# EAGLE design Adafruit PCA9685 rev C (EAGLE 9.6.2)
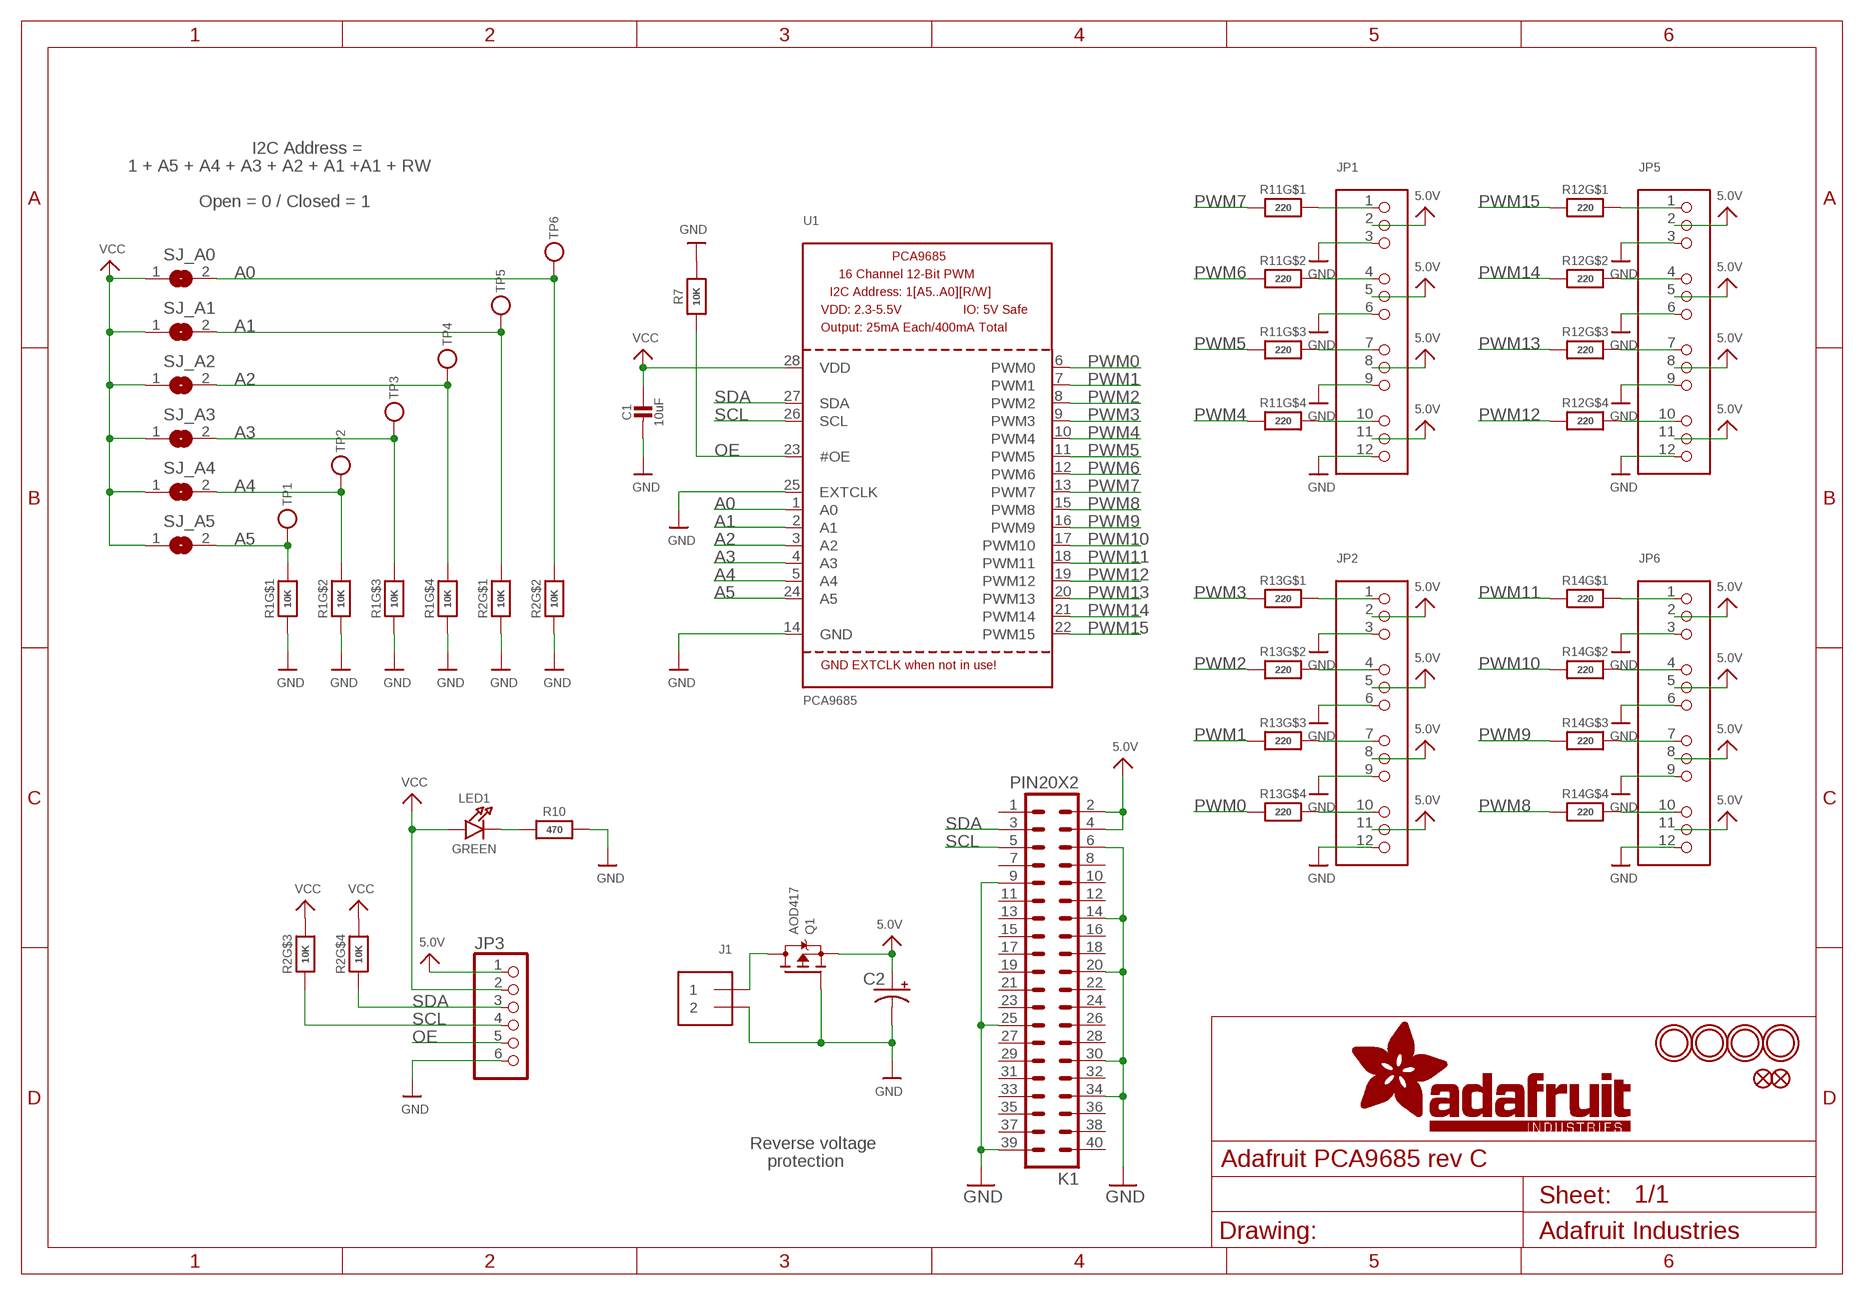
[diagram p0: schematic, sheet 1]

## Parts
C1  10uF  CAP_CERAMIC0805-NOOUTLINE  [0805-NO]
C2  CPOL-USE3.5-8  [E3,5-8]
FID1  FIDUCIAL""  [FIDUCIAL_1MM]
FID2  FIDUCIAL""  [FIDUCIAL_1MM]
J1  TERMBLOCK_1X2  [TERMBLOCK_1X2-3.5MM]
JP1  HEADER-3X04  [3X04]
JP2  HEADER-3X04  [3X04]
JP3  PINHD-1X6CB  [1X06-CLEANBIG]
JP5  HEADER-3X04  [3X04]
JP6  HEADER-3X04  [3X04]
K1  PIN20X2  [PIN_20X2]
LED1  GREEN  LED0805_NOOUTLINE  [CHIPLED_0805_NOOUTLINE]
Q1  AOD417  MOSFET-PTO252  [TO252]
R1  10K  RESISTOR_4PACK  [RESPACK_4X0603]
R2  10K  RESISTOR_4PACK  [RESPACK_4X0603]
R7  10K  RESISTOR0805_NOOUTLINE  [0805-NO]
R10  470  RESISTOR_0805MP  [_0805MP]
R11  220  RESISTOR_4PACK  [RESPACK_4X0603]
R12  220  RESISTOR_4PACK  [RESPACK_4X0603]
R13  220  RESISTOR_4PACK  [RESPACK_4X0603]
R14  220  RESISTOR_4PACK  [RESPACK_4X0603]
SJ_A0  SOLDERJUMPERREFLOW_NOPASTE  [SOLDERJUMPER_REFLOW_NOPASTE]
SJ_A1  SOLDERJUMPERREFLOW_NOPASTE  [SOLDERJUMPER_REFLOW_NOPASTE]
SJ_A2  SOLDERJUMPERREFLOW_NOPASTE  [SOLDERJUMPER_REFLOW_NOPASTE]
SJ_A3  SOLDERJUMPERREFLOW_NOPASTE  [SOLDERJUMPER_REFLOW_NOPASTE]
SJ_A4  SOLDERJUMPERREFLOW_NOPASTE  [SOLDERJUMPER_REFLOW_NOPASTE]
SJ_A5  SOLDERJUMPERREFLOW_NOPASTE  [SOLDERJUMPER_REFLOW_NOPASTE]
TP1  TESTPOINTROUND1MM  [TESTPOINT_ROUND_1MM]
TP2  TESTPOINTROUND1MM  [TESTPOINT_ROUND_1MM]
TP3  TESTPOINTROUND1MM  [TESTPOINT_ROUND_1MM]
TP4  TESTPOINTROUND1MM  [TESTPOINT_ROUND_1MM]
TP5  TESTPOINTROUND1MM  [TESTPOINT_ROUND_1MM]
TP6  TESTPOINTROUND1MM  [TESTPOINT_ROUND_1MM]
U1  PCA9685  [TSSOP28]
U$47  MOUNTINGHOLE2.5  [MOUNTINGHOLE_2.5_PLATED]
U$48  MOUNTINGHOLE2.5  [MOUNTINGHOLE_2.5_PLATED]
U$49  MOUNTINGHOLE2.5  [MOUNTINGHOLE_2.5_PLATED]
U$50  MOUNTINGHOLE2.5  [MOUNTINGHOLE_2.5_PLATED]

## Nets
5.0V: C2.+ JP1.2 JP1.5 JP1.8 JP1.11 JP2.2 JP2.5 JP2.8 JP2.11 JP3.1 JP5.2 JP5.5 JP5.8 JP5.11 JP6.2 JP6.5 JP6.8 JP6.11 K1.2 K1.4 Q1.2(S)
A0: R2.7 SJ_A0.2 TP6.P$1 U1.1(A0)
A1: R2.8 SJ_A1.2 TP5.P$1 U1.2(A1)
A2: R1.5 SJ_A2.2 TP4.P$1 U1.3(A2)
A3: R1.6 SJ_A3.2 TP3.P$1 U1.4(A3)
A4: R1.7 SJ_A4.2 TP2.P$1 U1.5(A4)
A5: R1.8 SJ_A5.2 TP1.P$1 U1.24(A5)
GND: C1.2 C2.- J1.2 JP1.3 JP1.6 JP1.9 JP1.12 JP2.3 JP2.6 JP2.9 JP2.12 JP3.6 JP5.3 JP5.6 JP5.9 JP5.12 JP6.3 JP6.6 JP6.9 JP6.12 K1.6 K1.9 K1.14 K1.20 K1.25 K1.30 K1.34 K1.39 Q1.1(G) R1.1 R1.2 R1.3 R1.4 R2.1 R2.2 R7.2 R10.2 U1.14(GND) U1.25(EXTCLK)
N$1: LED1.C R10.1
N$2: JP1.4 R11.7
N$3: JP1.1 R11.8
N$4: JP1.7 R11.6
N$5: JP1.10 R11.5
N$6: JP2.1 R13.8
N$7: JP2.4 R13.7
N$8: JP2.7 R13.6
N$9: JP2.10 R13.5
N$10: JP6.10 R14.5
N$11: JP6.7 R14.6
N$12: JP6.4 R14.7
N$13: JP6.1 R14.8
N$14: JP5.10 R12.5
N$15: JP5.7 R12.6
N$16: JP5.4 R12.7
N$17: JP5.1 R12.8
OE: JP3.5 R7.1 U1.23(#OE)
PWM0: R13.4 U1.6(PWM0)
PWM1: R13.3 U1.7(PWM1)
PWM2: R13.2 U1.8(PWM2)
PWM3: R13.1 U1.9(PWM3)
PWM4: R11.4 U1.10(PWM4)
PWM5: R11.3 U1.11(PWM5)
PWM6: R11.2 U1.12(PWM6)
PWM7: R11.1 U1.13(PWM7)
PWM8: R14.4 U1.15(PWM8)
PWM9: R14.3 U1.16(PWM9)
PWM10: R14.2 U1.17(PWM10)
PWM11: R14.1 U1.18(PWM11)
PWM12: R12.4 U1.19(PWM12)
PWM13: R12.3 U1.20(PWM13)
PWM14: R12.2 U1.21(PWM14)
PWM15: R12.1 U1.22(PWM15)
PWRIN: J1.1 Q1.3(D)
SCL: JP3.4 K1.5 R2.3 U1.26(SCL)
SDA: JP3.3 K1.3 R2.4 U1.27(SDA)
VCC: C1.1 JP3.2 LED1.A R2.5 R2.6 SJ_A0.1 SJ_A1.1 SJ_A2.1 SJ_A3.1 SJ_A4.1 SJ_A5.1 U1.28(VDD)
Unconnected: K1.1 K1.7 K1.8 K1.10 K1.11 K1.12 K1.13 K1.15 K1.16 K1.17 K1.18 K1.19 K1.21 K1.22 K1.23 K1.24 K1.26 K1.27 K1.28 K1.29 K1.31 K1.32 K1.33 K1.35 K1.36 K1.37 K1.38 K1.40

## Notes on the sheet
- I2C Address =
- 1 + A5 + A4 + A3 + A2 + A1 +A1 + RW
- Open = 0 / Closed = 1
- Reverse voltage
- protection

## Library data of the parts
C1 = microbuilder:CAP_CERAMIC: Ceramic Capacitors For new designs, use the packages preceded by an '_' character since they are more reliable: The following footprints should be used on most boards: _0402 - Standard footprint for regular board layouts _0603 - Standard footprint for regular board layouts _0805 - Standard footprint for regular board layouts _1206 - Standard footprint for regular board layouts For extremely tight-pitch boards where space is at a premium, the following 'micro-pitch' footprints can be used (smaller pads, no silkscreen outline, etc.): _0402MP - Micro-pitch footprint for very dense/compact boards _0603MP - Micro-pitch footprint for very dense/compact boards _0805MP - Micro-pitch footprint for very dense/compact boards _1206MP - Micro-pitch footprint for very dense/compact boards
C2 = adafruit:CPOL-US: POLARIZED CAPACITOR, American symbol
FID1 FID2 = microbuilder:FIDUCIAL: Fiducial Alignment Points Various fiducial points for machine vision alignment.; BOM: EXCLUDE
J1 = microbuilder:TERMBLOCK_1X2: 3.5mm Terminal block http://www.ladyada.net/library/pcb/eaglelibrary.html
JP1 JP2 JP5 JP6 = microbuilder:HEADER-3X04
JP3 = adafruit:PINHD-1X6: PIN HEADER
K1 = FLYFISH:PIN20X2
LED1 = microbuilder:LED: LED 0603 - 0603 Surface Mount Package 2mA: Green LED - Low Power (3.9mcd, 2ma, 1.7Vf) - Digikey: 475-2709-2-ND Orange LED - Low Power (9.8mcd, 2ma, 1.8Vf) - Digikey: 475-1194-2-ND Red LED - Low Power (5mcd, 2ma, 1.8Vf) - Digikey: 475-1195-2-ND Yellow LED - Low Power (7mcd, 2ma, 1.8Vf) - Digikey: 475-1196-2-ND 5mA: Blue LED - Low Power (17mcd, 5ma, 2.9Vf) - Digikey: LNJ937W8CRACT-ND 0805 - 0805 Surface Mount Package 2mA: Red LED (8.8mcd, 2mA, 1.8Vf, Clear) - Low Power [Digikey: 475-2510-1-ND] Green LED (5mcd, 2mA, 1.8Vf, Clear) - Low Power [Digikey: 475-2730-1-ND] Yellow LED (11.3mcd, 2mA, 1.8Vf, Clear) - Low Power [Digikey: 475-2555-1-ND] 20mA: Red LED (104mcd, 20mA, Diffused) - LS R976 [Digikey: 475-1278-6-ND] Red LED (12mcd, 20mA, 2.0Vf, Clear) - APT2012EC [Digikey: 754-1128-1-ND] Green LED (15mcd, 20mA, 2.2Vf, Clear) - APT2012GC [Digikey: 754-1131-1-ND] Orange LED (160mcd, 20mA, 2.1Vf, Clear) - APT2012SECK [Digikey: 754-1130-1-ND] 1206 - 1206 Surface Mount Package Green LED (26mcd, 20mA, Diffused) - LG N971 [Digikey: 475-1407-6-ND] Red LED (15mcd, 20mA, Diffused) - LH N974 [Digikey: 475-1416-6-ND] Cree - Cree High-Power Surface Mount LEDs XPEBWT-L1-0000-00D50 - White 111lm 350mA 2.9Vf 6200K 110° XTEAWT-00-0000-00000LEE3 - White 114lm 350mA 2.85Vf 5000K 115° Everlight - Everlight 45-21 Series Surface Mount LEDs 45-21/QK2C-B2832AC2CB2/2T - Warm White 2000mcd 20mA 3.25Vf 3050K 120° 45-21/LK2C-B38452C4CB2/2T - Nuetral White 2000mcd 20mA 3.25Vf 4150K 120° 45-21/LK2C-B50634C6CB2/2T - Cold White 2200mcd 20mA 3.25Vf 5650K 120° PLCC2 Reverse Mount LS T77K-J1L2-1-0-2-R18-Z - Red 11.25mcd 2mA 1.8Vf 630nm 120° LO T77K-L1M2-24-Z - Orange 19.6mcd 2mA 1.8Vf 606nm 120° LY T77K-K2M1-26-Z - Yellow 15.7mcd 2mA 1.8Vf 587nm 120°
Q1 = microbuilder:MOSFET-P: P-Channel Mosfet LEGEND VDS: Voltage Drain-Source ID: Drain Current RDS(ON): Drain-Source On-State Resistance VGS(TH): Gate-Source Threshold Voltage CISS: Drain-Source Input Capacitance SOT-23 Name VDS ID RDS(ON) VGS(TH) CISS Order Number IRLML5103 30V 760mA 600 mOhm -- 75pF @ 25V Digikey: IRLML5103PBFCT-ND IRLML6401 12V 4.3A 50 mOhm 950mV @ 250µA 830pF @ 10V Digikey: IRLML6401PBFTR-ND NTR0202PL 20V 400mA 800 mOhm 2.3V @ 250uA 70pF @ 5V Digikey: NTR0202PLT1GOSTR-ND NTR4101PT1G 20V 1.8A 85 mOhm 1.2V @ 250uA 675pF @ 10V Digikey: NTR4101PT1GOSCT-ND DMP2004K 20V 600mA 900 mOhm 1V @ 250uA 175pF @ 16V Digikey: DMP2004KDICT-ND PMV65XP 20V 3.9A 76 mOhm 950mV @ 1mA 725pF @ 20V Digikey: 568-2358-2-ND TO-252 Name VDS ID RDS(ON) VGS(TH) CISS Order Number AOD417 30V 25A 34 mOhm 3V @ 250µA 920pF @ 15V Digikey: 785-1106-2-ND
R1 R2 R11-R14 = microbuilder:RESISTOR_4PACK: Resistor Packs (4 resistors) 4 x 0603 10K 1/16W - Digikey: YC164J-10KCT-ND
R7 R10 = microbuilder:RESISTOR: Resistors For new designs, use the packages preceded by an '_' character since they are more reliable: The following footprints should be used on most boards: _0402 - Standard footprint for regular board layouts _0603 - Standard footprint for regular board layouts _0805 - Standard footprint for regular board layouts _1206 - Standard footprint for regular board layouts For extremely tight-pitch boards where space is at a premium, the following 'micro-pitch' footprints can be used (smaller pads, no silkscreen outline, etc.): _0402MP - Micro-pitch footprint for very dense/compact boards _0603MP - Micro-pitch footprint for very dense/compact boards _0805MP - Micro-pitch footprint for very dense/compact boards _1206MP - Micro-pitch footprint for very dense/compact boards
SJ_A0 SJ_A1-SJ_A5 = microbuilder:SOLDERJUMPER: SMD Solder JUMPER Solder the two pads together to create a connection, or remove the solder to break it. REFLOW - Use this footprint for solder paste and reflow ovens. WAVE - Use this footprint for hand-soldering (larger pads). CLOSED - Has a trace between the two pads to ensure it is closed by default. The trace needs to be cut to disable the jumper, and can be closed again by creating a solder bridge between the two pads.
TP1-TP6 = microbuilder:TESTPOINT: Test Point Various test points for characterisation and PCB testing TESTPOINT_SMT - Compact Surface Mount Test Point [Digikey: 5016KTR-ND]
U1 = microbuilder:PCA9685: PCA9685 - 16 Channel 12-Bit I2C PWM Controller 5.0V tolerant 16 channel, 12-bit I2C PWM controller with 25mA per output (max. 400mA total) Digikey: 568-5931-1-ND
U$47-U$50 = microbuilder:MOUNTINGHOLE: Mounting Hole For #2 screws (0.086"/2.18mm width, 0.094"/2.4mm hole) use 2.5mm; BOM: EXCLUDE

## Board
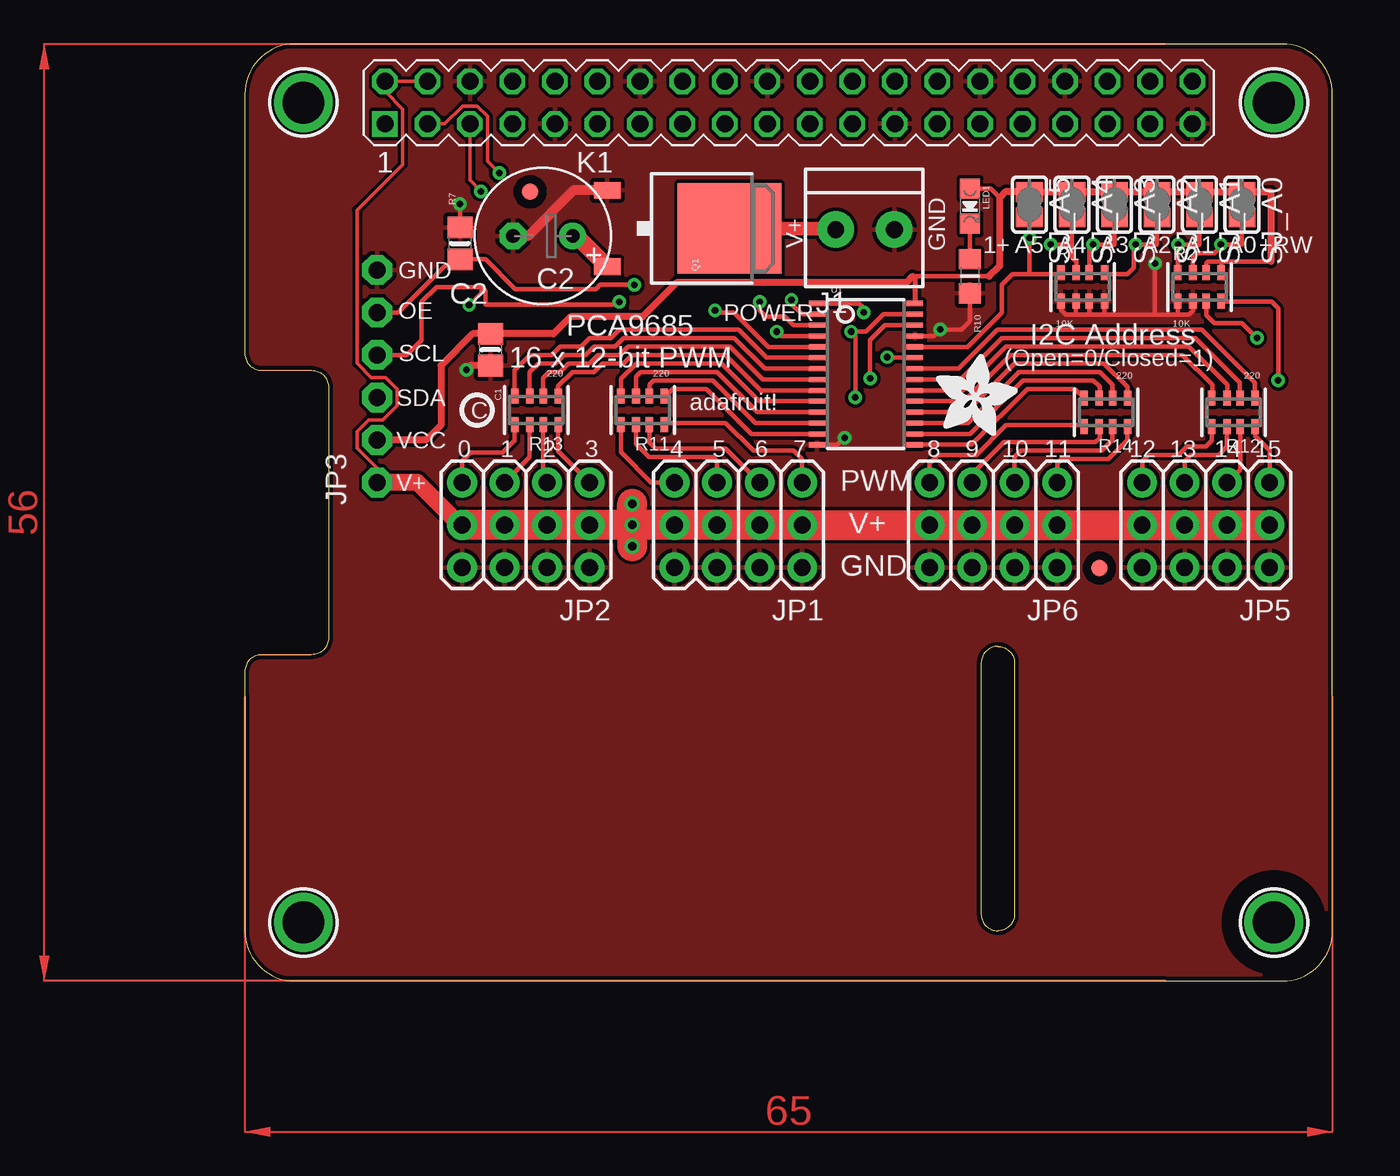
[diagram p1: board, top side]
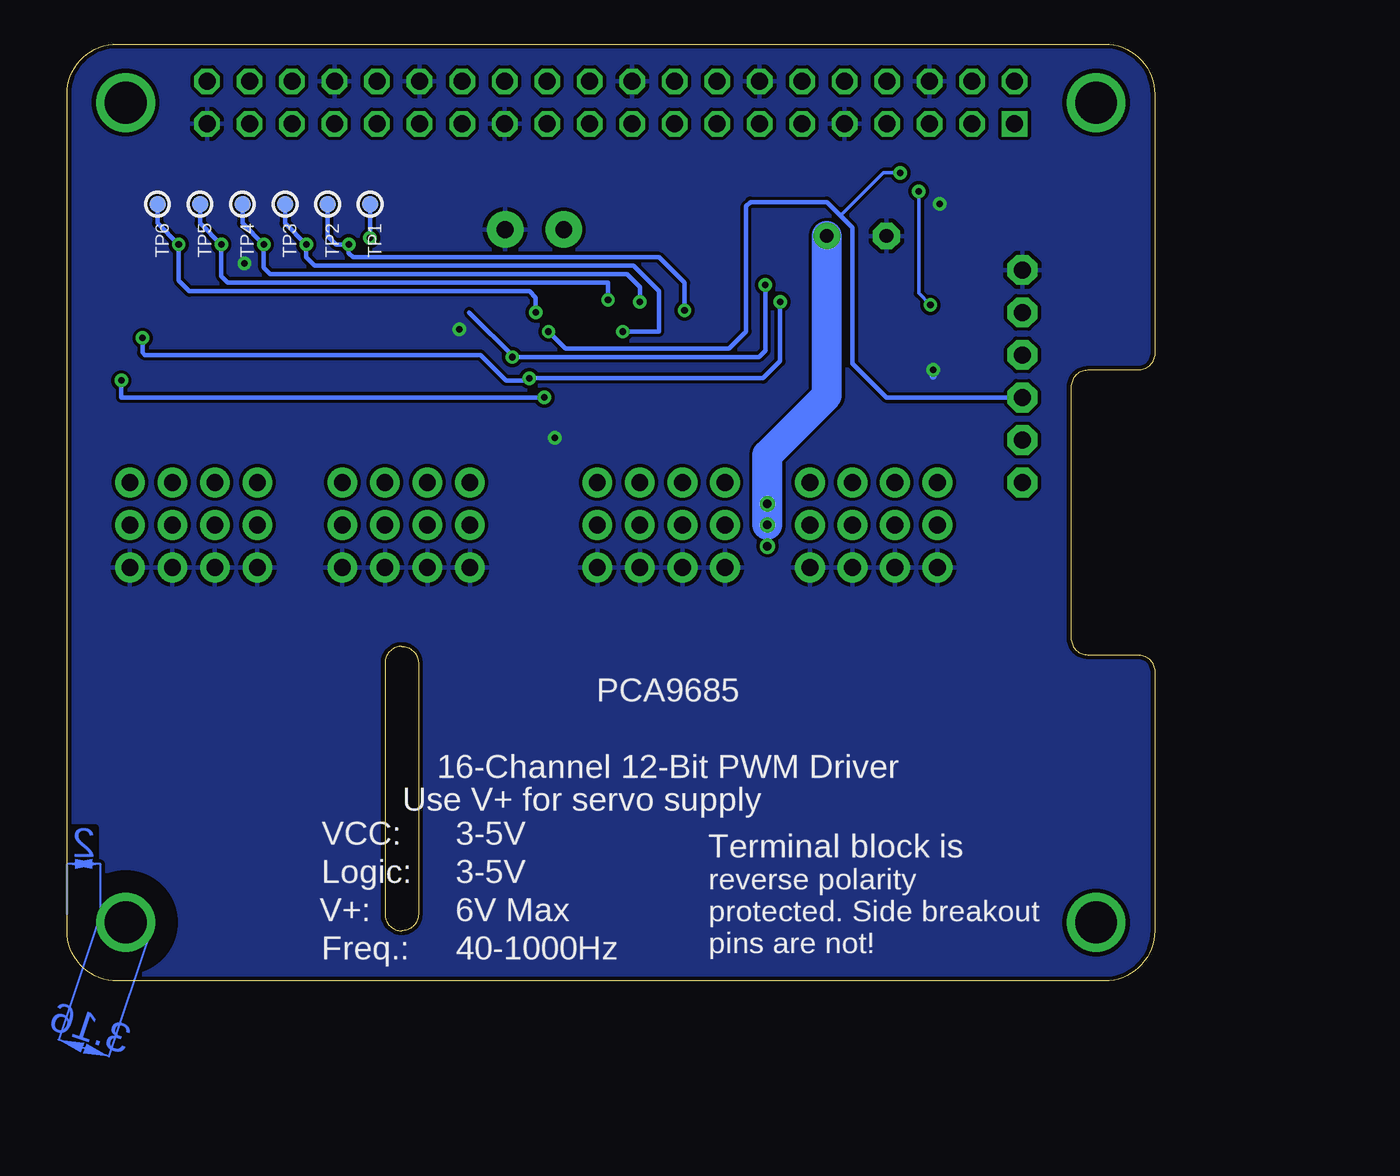
[diagram p2: board, bottom side, seen from below]

Size 65 x 56 mm. Coordinates in mm from the lower left corner, seen from the top.
Outline: 0,3 arc90 3,0 62,0 arc90 65,3 65,53 arc90 62,56 3,56 arc90 0,53 0,37.5 arc90 1,36.5 4,36.5 arc-90 5,35.5 5,20.5 arc-90 4,19.5 1,19.5 arc90 0,18.5 0,3
Outline: 44,19 44,4 arc90 45,3 arc90 46,4 46,19 arc90 45,20 arc90 44,19
Copper layers (1*16): Top 0.035mm / dielectric 1.5mm / Bottom 0.035mm
Design rules "adafruit": minimum track width 8mil, minimum drill 15.5mil, track to track 8mil, track to pad 8mil, pad to pad 8mil, via to via 8mil, smd to smd 8mil, copper to edge 10mil, drill to drill 8mil, minimum pad ring 10mil, minimum via ring 8mil, stop-mask expansion 2mil, vias tented up to drill 20mil, thermal gap 10mil
tRestrict: area -114.2,73.7 to -111.1,76.8; area -56.2,73.7 to -53.1,76.8; area -56.2,24.7 to -53.1,27.8; area -114.2,24.7 to -111.1,27.8; area -95,71 to -92,74; area -37,71 to -34,74; area -37,21.9 to -34,25.1; area -95,21.9 to -92,25.1; area 60,1.9 to 63,5
bRestrict: area -114.2,24.7 to -111.1,27.8; area -114.2,73.7 to -111.1,76.8; area -56.2,24.7 to -53.1,27.8; area -56.2,73.7 to -53.1,76.8; area -95,21.9 to -92,25.1; area -95,71 to -92,74; area -37,21.9 to -34,25.1; area -37,71 to -34,74; area 60,1.9 to 63,5

### Footprints (pad centres in the part's own frame; a part is rotated, then mirrored left to right if it is on the bottom)
0805-NO = smd 1.3 x 1.5: 1 -0.95,0; 2 0.95,0
E3,5-8 = drill 0.813 pad 1.6: + -1.778,0 | drill 0.813 pad 1.6 octagon: - 1.778,0
FIDUCIAL_1MM = smd 1 x 1: 1 0,0
TERMBLOCK_1X2-3.5MM = drill 1 pad 2.184: 1 1.8,0; 2 -1.7,0
3X04 = drill 1 pad 1.778: 1 -3.81,-2.54; 2 -3.81,0; 3 -3.81,2.54; 4 -1.27,-2.54; 5 -1.27,0; 6 -1.27,2.54; 7 1.27,-2.54; 8 1.27,0; 9 1.27,2.54; 10 3.81,-2.54; 11 3.81,0; 12 3.81,2.54
1X06-CLEANBIG = drill 1.016 pad 1.778 octagon: 1 -6.35,0; 2 -3.81,0; 3 -1.27,0; 4 1.27,0; 5 3.81,0; 6 6.35,0
PIN_20X2 = drill 1.016 square: 1 -24.13,-1.27 | drill 1.016 octagon: 2 -24.13,1.27; 3 -21.59,-1.27; 4 -21.59,1.27; 5 -19.05,-1.27; 6 -19.05,1.27; 7 -16.51,-1.27; 8 -16.51,1.27; 9 -13.97,-1.27; 10 -13.97,1.27; 11 -11.43,-1.27; 12 -11.43,1.27; 13 -8.89,-1.27; 14 -8.89,1.27; 15 -6.35,-1.27; 16 -6.35,1.27; 17 -3.81,-1.27; 18 -3.81,1.27; 19 -1.27,-1.27; 20 -1.27,1.27; 21 1.27,-1.27; 22 1.27,1.27; 23 3.81,-1.27; 24 3.81,1.27; 25 6.35,-1.27; 26 6.35,1.27; 27 8.89,-1.27; 28 8.89,1.27; 29 11.43,-1.27; 30 11.43,1.27; 31 13.97,-1.27; 32 13.97,1.27; 33 16.51,-1.27; 34 16.51,1.27; 35 19.05,-1.27; 36 19.05,1.27; 37 21.59,-1.27; 38 21.59,1.27; 39 24.13,-1.27; 40 24.13,1.27
CHIPLED_0805_NOOUTLINE = smd 1.2 x 1.2: A 0,-1.05; C 0,1.05
TO252 = smd 1 x 1.6: 1 -2.28,-4.8; 2 2.28,-4.8 | smd 5.4 x 6.2: 3 0,2.5
RESPACK_4X0603 = smd 0.45 x 0.9: 1 -1.3,-0.85; 2 -0.4,-0.85; 3 0.4,-0.85; 4 1.3,-0.85; 5 1.3,0.85; 6 0.4,0.85; 7 -0.4,0.85; 8 -1.3,0.85
_0805MP = smd 1.2 x 1.3: 1 -1.016,0; 2 1.016,0
SOLDERJUMPER_REFLOW_NOPASTE = smd 1.168 x 1.6: 1 -0.762,0; 2 0.762,0
TESTPOINT_ROUND_1MM = smd 1 x 1: P$1 0,0
TSSOP28 = smd 0.305 x 0.991: 1 -4.225,-2.918; 2 -3.575,-2.918; 3 -2.925,-2.918; 4 -2.275,-2.918; 5 -1.625,-2.918; 6 -0.975,-2.918; 7 -0.325,-2.918; 8 0.325,-2.918; 9 0.975,-2.918; 10 1.625,-2.918; 11 2.275,-2.918; 12 2.925,-2.918; 13 3.575,-2.918; 14 4.225,-2.918; 15 4.225,2.918; 16 3.575,2.918; 17 2.925,2.918; 18 2.275,2.918; 19 1.625,2.918; 20 0.975,2.918; 21 0.325,2.918; 22 -0.325,2.918; 23 -0.975,2.918; 24 -1.625,2.918; 25 -2.275,2.918; 26 -2.925,2.918; 27 -3.575,2.918; 28 -4.225,2.918
MOUNTINGHOLE_2.5_PLATED = drill 2.5 pad 3.2: P$1 0,0

### Placement (x,y rotation side)
C1  14.68,37.73 270 top
C2  17.81,44.53 180 top
FID1  51.07,24.68 0 top
FID2  17.05,47.17 0 top
J1  37.12,44.91 180 top
JP1  29.5,27.26 180 top
JP2  16.8,27.26 180 top
JP3  7.91,36.15 90 top
JP5  57.44,27.26 180 top
JP6  44.73,27.26 180 top
K1  32.5,52.5 0 top
LED1  43.34,46.31 180 top
Q1  26.46,44.97 270 top
R1  50.07,41.48 0 top
R2  57.05,41.48 0 top
R7  12.86,44.08 90 top
R10  43.34,42.12 270 top
R11  23.78,34.11 180 top
R12  59.09,33.99 180 top
R13  17.43,34.11 180 top
R14  51.47,33.99 180 top
SJ_A0  59.59,46.4 270 top
SJ_A1  57.05,46.4 270 top
SJ_A2  54.51,46.4 270 top
SJ_A3  51.97,46.4 270 top
SJ_A4  49.43,46.4 270 top
SJ_A5  46.89,46.4 270 top
TP1  46.89,46.43 270 bottom
TP2  49.43,46.43 270 bottom
TP3  51.97,46.43 270 bottom
TP4  54.51,46.43 270 bottom
TP5  57.05,46.43 270 bottom
TP6  59.59,46.43 270 bottom
U1  37.12,36.27 270 top
U$47  61.5,52.5 0 top
U$48  3.5,52.5 0 top
U$49  3.5,3.5 0 top
U$50  61.5,3.5 0 top
U$51  [ADAFRUIT_5MM]  41.31,32.59 0 top
U$54  [PCBFEAT-REV-040]  13.87,34.11 0 top

### Tracks (layer width: path | path; a pad name or v marks a point on that pad's centre or on a via)
5.0V  (via drill 0.5)
  Top 0.203: K1.4 K1.2 8.37,53.19 9.44,52.12 9.44,48.8 6.71,46.08 6.71,36.92 7.56,36.07 8.4,36.07 9.1,35.37 9.1,34.38 8.25,33.53 7.41,33.53 6.71,32.83 6.71,31.84 7.91,30.65 JP3.1
  Top 0.254: JP2.11 12.86,27.26 | JP5.2 61.63,27.26
  Top 1.016: JP3.1 10.32,29.8 12.86,27.26 | Q1.2 19.83,44.53 C2.+
  Top 1.778: JP2.11 JP2.8 JP2.5 JP2.2 v23.14,27.26 | v23.14,27.26 JP1.11 JP1.8 JP1.5 JP1.2 JP6.11 JP6.8 JP6.5 JP6.2 JP5.11 JP5.8 JP5.5 JP5.2 | v23.14,27.26 v23.14,28.53 | v23.14,27.26 v23.14,25.99
  Bottom 1.778: C2.+ 19.59,35 23.14,31.45 v23.14,27.26
A0  (via drill 0.39)
  Top 0.254: SJ_A0.2 59.59,44.02 v58.32,44.02 58.32,43.89 57.94,43.51 56.93,43.51 56.65,43.24 R2.7 | v36.99,39.96 36.99,40.21 36.7,40.5 U1.1
  Bottom 0.254: v36.99,39.96 36.99,40.84 37.37,41.23 57.69,41.23 58.32,41.86 v58.32,44.02 59.59,45.29 TP6.P$1
A1  (via drill 0.39)
  Top 0.254: SJ_A1.2 57.05,44.02 v55.78,44.02 55.75,43.99 R2.8 | U1.2 33.29,39.85 32.67,40.46 v32.67,40.72
  Bottom 0.254: v32.67,40.72 32.67,41.73 55.4,41.73 55.78,42.12 v55.78,44.02 57.05,45.29 TP5.P$1
A2  (via drill 0.39)
  Top 0.254: SJ_A2.2 54.51,44.02 v53.24,44.02 53.12,43.89 53.12,42.62 52.74,42.24 51.46,42.24 R1.5 | U1.3 32.79,39.2 32.29,39.7 31.15,39.7 30.77,40.08 v30.77,40.59
  Bottom 0.254: v30.77,40.59 30.77,41.48 31.53,42.24 52.86,42.24 53.24,42.62 v53.24,44.02 54.51,45.29 TP4.P$1
A3  (via drill 0.39)
  Top 0.254: SJ_A3.2 51.97,44.02 v50.7,44.02 50.47,43.78 R1.6 | U1.4 32.05,38.55 v31.78,38.81
  Bottom 0.254: v31.78,38.81 29.62,38.81 29.62,41.23 31.15,42.75 50.2,42.75 50.7,43.26 v50.7,44.02 51.97,45.29 TP3.P$1
A4  (via drill 0.39)
  Top 0.254: 49.43,44.02 SJ_A4.2 | v48.16,44.02 49.43,44.02 | U1.5 31.3,37.9 29.24,39.96 28.23,39.96 v28.1,40.08 | 49.43,44.02 49.43,43.26 49.69,43 49.69,42.35 R1.7
  Bottom 0.254: v28.1,40.08 28.1,41.73 29.62,43.26 47.91,43.26 48.16,43.51 v48.16,44.02 48.93,44.02 49.43,44.53 TP2.P$1
A5  (via drill 0.39)
  Top 0.254: U1.24 43.19,37.9 45.24,39.96 45.24,41.61 45.88,42.24 46.89,42.24 | SJ_A5.2 v46.89,44.4 46.89,42.24 | 46.89,42.24 48.68,42.24 R1.8
  Bottom 0.254: TP1.P$1 v46.89,44.4
GND  (via drill 0.39)
  Top 0.254: v12.86,46.43 R7.2 | U1.14 35.43,32.05 v35.84,32.46 | U1.25 41.17,38.55 v41.56,38.94 42.83,38.94 43.34,39.45 R10.2 | R1.1 48.77,40.11 49.05,39.83 49.69,39.83 | 49.69,39.83 50.45,39.83 | 50.45,39.83 51.47,39.83 | 51.47,39.83 54.39,39.83 | 54.39,39.83 55.78,39.83 | 55.78,39.83 56.42,39.83 56.67,40.08 56.67,40.61 R2.2 | v54.39,42.88 54.39,39.83 | R2.1 55.75,39.86 55.78,39.83 | R1.2 49.67,39.85 49.69,39.83 | R1.3 50.47,39.85 50.45,39.83 | R1.4 51.37,39.93 51.47,39.83
  Top 0.406: C1.2 13.49,36.78 v13.24,36.53
  Top 0.61: Q1.1 19.65,47.25 16.92,44.53 C2.-
  Bottom 0.254: v41.56,38.94 41.81,38.94
  Bottom 0.406: v13.24,36.53 13.24,36.15
  pour Bottom: 0,3 arc90 3,0 62,0 arc90 65,3 65,53 arc90 62,56 3,56 arc90 0,53 0,37.5 arc90 1,36.5 4,36.5 arc-90 5,35.5 5,20.5 arc-90 4,19.5 1,19.5 arc90 0,18.5
  pour Top: 0,3 arc90 3,0 62,0 arc90 65,3 65,53 arc90 62,56 3,56 arc90 0,53 0,37.5 arc90 1,36.5 4,36.5 arc-90 5,35.5 5,20.5 arc-90 4,19.5 1,19.5 arc90 0,18.5
N$1
  Top 0.254: R10.1 LED1.C
N$2
  Top 0.254: JP1.4 28.73,31.83 24.54,31.83 24.16,32.21 24.18,32.23 R11.7
N$3
  Top 0.254: JP1.1 33.3,31.19 32.8,31.7 30.38,31.7 28.73,33.35 25.17,33.35 R11.8
N$4
  Top 0.254: JP1.7 28.23,31.07 27.97,31.32 24.16,31.32 23.38,32.1 R11.6
N$5
  Top 0.254: JP1.10 24.29,29.8 22.48,31.6 R11.5
N$6
  Top 0.254: JP2.1 18.73,31.67 R13.8
N$7
  Top 0.254: R13.7 17.83,30.03 JP2.4
N$8
  Top 0.254: R13.6 17.03,31.3 JP2.7
N$9
  Top 0.254: R13.5 16.13,32.31 15.4,31.57 13.49,31.57 12.98,31.07 JP2.10
N$10
  Top 0.254: JP6.10 40.92,30.94 41.43,31.45 43.72,31.45 45.5,33.23 50.17,33.23 R14.5
N$11
  Top 0.254: JP6.7 43.47,30.3 45.37,32.21 50.83,32.21 51.09,32.46 51.09,33.12 R14.6
N$12
  Top 0.254: JP6.4 46.01,31.32 46.39,31.7 51.21,31.7 51.85,32.34 51.85,33.12 R14.7
N$13
  Top 0.254: JP6.1 48.55,30.94 48.8,31.19 51.59,31.19 52.74,32.34 52.74,33.11 R14.8
N$14
  Top 0.254: R12.5 57.79,32.31 57.44,31.95 56.29,31.95 55.78,31.45 54.01,31.45 53.62,31.07 JP5.10
N$15
  Top 0.254: R12.6 58.69,31.94 58.2,31.45 56.55,31.45 56.16,31.07 JP5.7
N$16
  Top 0.254: R12.7 59.49,30.58 JP5.4
N$17
  Top 0.254: JP5.1 61.24,31.7 60.39,32.56 R12.8
OE  (via drill 0.39)
  Top 0.254: JP3.5 9.18,39.96 11.97,42.75 12.86,42.75 | U1.23 38.43,37.25 v38.38,37.29 | 12.98,42.75 12.86,42.75 | 12.86,42.75 R7.1 14.38,43.13 16.16,41.35 20.98,41.35 21.23,41.61 v23.27,41.61
  Bottom 0.254: 40.97,39.96 38.26,37.25 38.43,37.25 v38.38,37.29 23.65,37.29 23.27,37.67 v23.27,41.61
PWM0
  Top 0.254: U1.6 31.19,37.25 29.5,38.94 22.38,38.94 21.88,38.43 20.61,38.43 20.1,37.92 18.83,37.92 18.32,37.42 17.05,37.42 16.13,36.5 R13.4
PWM1
  Top 0.254: U1.7 31.07,36.6 29.24,38.43 22.64,38.43 22.13,37.92 20.86,37.92 20.35,37.42 19.08,37.42 18.57,36.91 17.56,36.91 17.03,36.38 R13.3
PWM2
  Top 0.254: U1.8 30.96,35.95 28.99,37.92 22.89,37.92 22.38,37.42 21.11,37.42 20.61,36.91 19.34,36.91 18.83,36.4 18.19,36.4 17.81,36.02 17.83,36 R13.2
PWM3
  Top 0.254: U1.9 30.85,35.3 28.73,37.42 23.14,37.42 22.64,36.91 21.37,36.91 20.86,36.4 19.59,36.4 18.73,35.54 R13.1
PWM4
  Top 0.254: U1.10 30.74,34.65 28.48,36.91 23.4,36.91 22.48,35.99 R11.4
PWM5
  Top 0.254: U1.11 30.63,34 28.23,36.4 23.65,36.4 23.38,36.13 R11.3
PWM6
  Top 0.254: U1.12 30.52,33.35 27.97,35.89 24.41,35.89 24.18,35.66 R11.2
PWM7
  Top 0.254: U1.13 30.28,32.7 27.59,35.38 25.56,35.38 25.08,34.91 R11.1
PWM8
  Top 0.254: U1.15 43.43,32.05 46.77,35.38 49.62,35.38 R14.4
PWM9
  Top 0.254: U1.16 43.32,32.7 46.51,35.89 50.7,35.89 51.09,35.51 51.09,34.86 R14.3
PWM10
  Top 0.254: U1.17 43.21,33.35 46.26,36.4 51.09,36.4 51.85,35.64 51.85,34.86 R14.2
PWM11
  Top 0.254: U1.18 43.09,34 46.01,36.91 51.34,36.91 52.74,35.51 52.74,34.87 R14.1
PWM12
  Top 0.254: U1.19 42.98,34.65 45.75,37.42 56.04,37.42 57.82,35.64 57.82,34.87 R12.4
PWM13
  Top 0.254: U1.20 42.87,35.3 45.5,37.92 56.42,37.92 58.7,35.64 58.7,34.86 R12.3
PWM14
  Top 0.254: U1.21 42.76,35.95 45.24,38.43 56.8,38.43 59.47,35.77 59.47,34.86 R12.2
PWM15
  Top 0.254: U1.22 42.65,36.6 44.99,38.94 57.18,38.94 60.36,35.77 60.36,34.87 R12.1
PWRIN
  Top 0.813: Q1.3 35.25,44.97 J1.1
SCL  (via drill 0.39)
  Top 0.203: K1.5 13.45,47.85 v14.1,47.2 | 14.13,41.48 14.13,41.13 v13.4,40.4
  Top 0.254: JP3.4 9.68,37.42 10.57,38.3 10.57,40.59 11.46,41.48 14.13,41.48 14.38,41.23 14.38,40.41 22.21,40.41 v22.38,40.59 | v37.37,36.02 37.37,38.3 38.26,39.2 U1.26 | R2.3 57.45,39.81 57.94,39.32 59.59,39.32 v60.48,38.43
  Bottom 0.203: v14.1,47.2 14.1,41.1 v13.4,40.4
  Bottom 0.254: v22.38,40.59 22.38,37.03 23.4,36.02 v37.37,36.02 37.5,35.89 38.77,35.89 40.29,37.42 60.36,37.42 60.48,37.54 v60.48,38.43
SDA  (via drill 0.39)
  Top 0.203: K1.3 11.94,51.23 13.01,52.3 13.89,52.3 14.52,51.67 14.52,48.98 v15.2,48.3
  Top 0.254: U1.27 38.15,39.85 37.12,38.81 v36.23,38.81 36.48,38.56 v36.48,34.88 | v61.75,35.89 61.75,40.21 61.36,40.6 58.38,40.6 R2.4
  Bottom 0.203: v15.2,48.3 16.2,48.3 18.77,45.74
  Bottom 0.254: v36.48,34.88 61.75,34.88 v61.75,35.89 | JP3.3 16.03,34.88 18.07,36.91 18.07,45.04 18.77,45.74 19.59,46.56 24.16,46.56 24.41,46.31 24.41,38.81 25.43,37.8 35.21,37.8 v36.23,38.81
VCC
  Top 0.254: 39.91,42.12 44.48,42.12 | R2.6 57.45,42.9 57.56,43 58.32,43 | 58.32,43 61.31,43 | R2.5 58.35,42.97 58.32,43 | LED1.A 44.57,47.36 45.12,46.81
  Top 0.305: 40.03,41.99 U1.28
  Top 0.406: JP3.2 10.83,32.34 11.71,33.23 11.71,36.78 13.62,38.69 C1.1 | 44.48,42.12 45.12,42.75 45.12,46.81 45.5,47.2 46.86,47.2 SJ_A5.1 SJ_A4.1 SJ_A3.1 SJ_A2.1 SJ_A1.1 SJ_A0.1 61.31,47.16 61.31,43 | 40.03,41.99 39.91,42.12 39.53,41.73 25.81,41.73 23.78,39.7 19.46,39.7 18.45,38.69 C1.1 | C1.1
(copper drawn outside any net)
  shapes: Bottom area x2, Top area x2

### Text on the board
tPlace: V+ | GND | 1+ | A5 | A4 | A3 | A2 | A1 | A0 | +RW | GND | C2 | OE | PCA9685 | POWER | I2C Address | SCL | 16 x 12-bit PWM | (Open=0/Closed=1) | SDA | adafruit! | VCC | 0 | 1 | 2 | 3 | 4 | 5 | 6 | 7 | 8 | 9 | 10 | 11 | 12 | 13 | 14 | 15 | V+ | PWM | V+ | GND
bPlace: PCA9685 | 16-Channel 12-Bit PWM Driver | Use V+ for servo supply | 3-5V | VCC: | Terminal block is | 3-5V | Logic: | reverse polarity | protected. Side breakout | 6V Max | V+: | pins are not! | 40-1000Hz | Freq.:
tValues: 10K | 10K | 220 ohm | 220 ohm